# Altium schematic sheet 03-GPS.SchDoc
size A4; DocumentNumber: 19; SheetNumber: 19; SheetTotal: 34
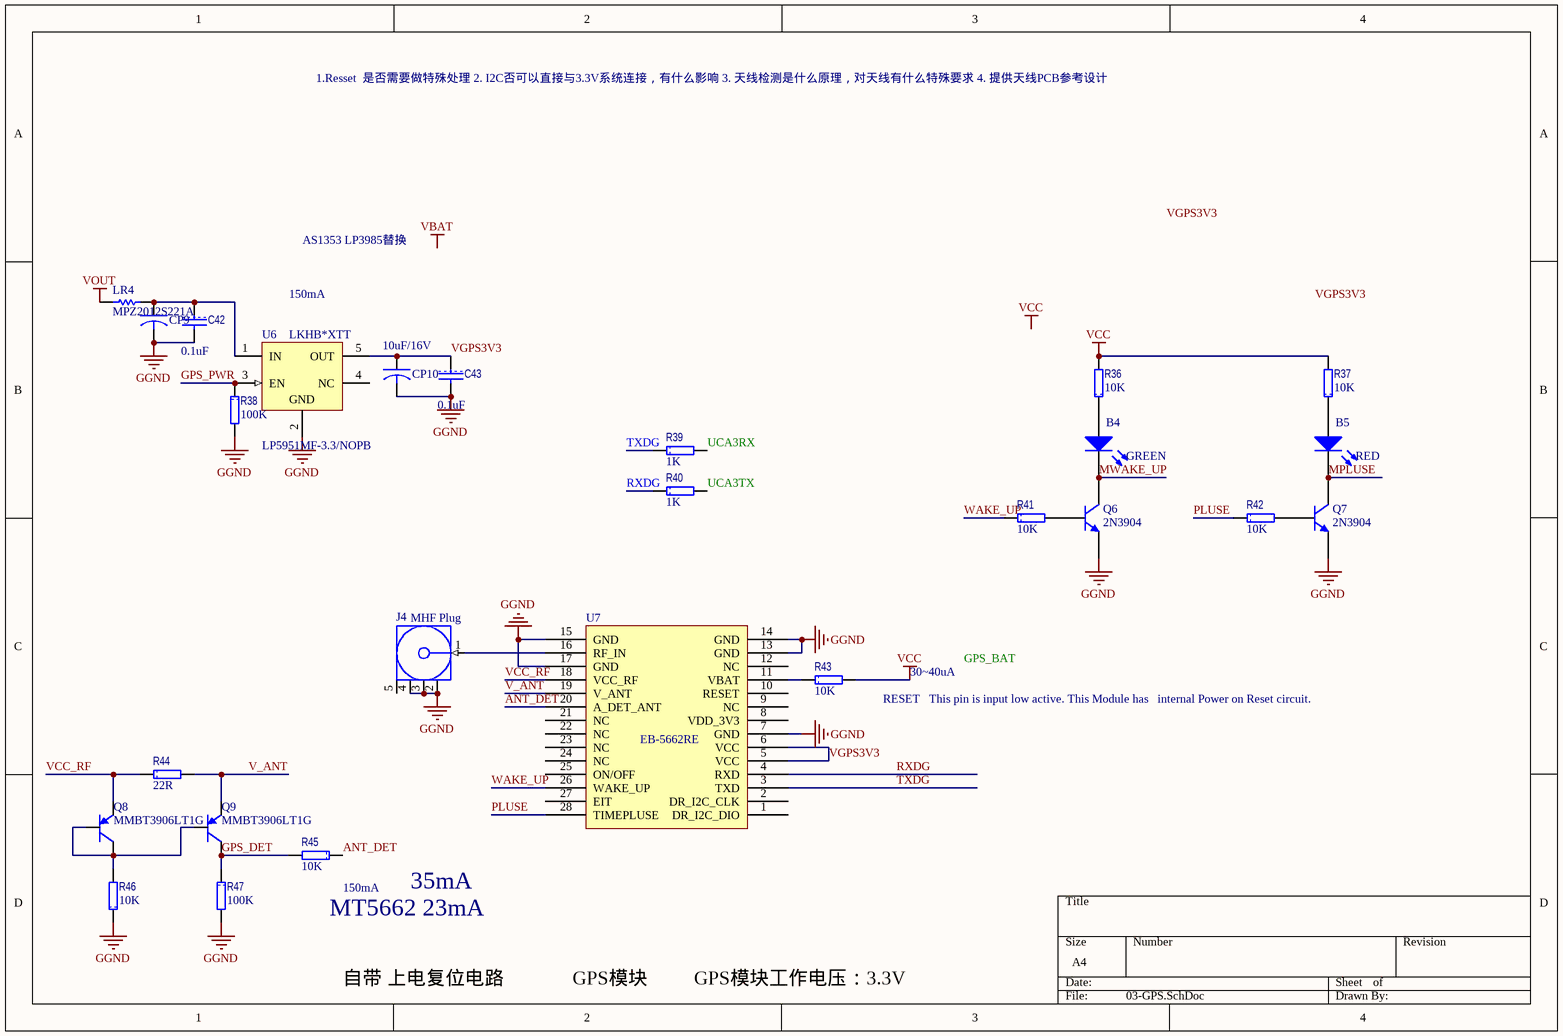
[diagram p0: 03-GPS.SchDoc]

## Parts
B4  GREEN  [0805LED]
B5  RED  [0805LED]
C42  value 0.1uF  [1608[0603]C]  (hidden comment: C1608X7R1H104K)
C43  value 0.1uF  [1608[0603]C]  (hidden comment: C1608X7R1H104K)
CP9  TAJA106K016RNJ  [3216[1206]CB]  (value not drawn)
CP10  value 10uF/16V  [3216[1206]CB]  (hidden comment: TAJA106K016RNJ)
J4  MHF Plug  [MHF[MCB3]-V4]
LR4  MPZ2012S221A  [2012[0805]]
Q6  2N3904  [SOT23_N]
Q7  2N3904  [SOT23_N]
Q8  MMBT3906LT1G  [SOT23_N]
Q9  MMBT3906LT1G  [SOT23_N]
R36  value 10K  [1608[0603]R]  (hidden comment: CRCW060310K0FKEA)
R37  value 10K  [1608[0603]R]  (hidden comment: CRCW060310K0FKEA)
R38  value 100K  [1608[0603]R]  (hidden comment: CRCW0603100KFKEA)
R39  value 1K  [1608[0603]R]  (hidden comment: CRCW06031K00FKEA)
R40  value 1K  [1608[0603]R]  (hidden comment: CRCW06031K00FKEA)
R41  value 10K  [1608[0603]R]  (hidden comment: CRCW060310K0FKEA)
R42  value 10K  [1608[0603]R]  (hidden comment: CRCW060310K0FKEA)
R43  value 10K  [1608[0603]R]  (hidden comment: CRCW060310K0FKEA)
R44  value 22R  [1608[0603]R]  (hidden comment: CRCW060322R0FKEA)
R45  value 10K  [1608[0603]R]  (hidden comment: CRCW060310K0FKEA)
R46  value 10K  [1608[0603]R]  (hidden comment: CRCW060310K0FKEA)
R47  value 100K  [1608[0603]R]  (hidden comment: CRCW0603100KFKEA)
U6  LP5951MF-3.3/NOPB  PackageTopMarking: LKHB*XTT  [MF05A_N]
U7  EB-5662RE  [EB-5662RE]

## Nets
GGND: C42.2 C43.2 CP9.2 CP10.2 J4.2(GND) J4.3(GND) J4.4(GND) Q6.1(E) Q7.1(E) R38.2 R46.1 R47.2 U6.2(GND) U7.7(GND) U7.13(GND) U7.14(GND) U7.15(GND) U7.17(GND)
VCC: R36.2 R37.2 R43.2
VOUT: LR4.1
ANT_DET: R45.1 U7.20(A_DET_ANT)
GPS_DET: Q9.3 R45.2 R47.1
GPS_PWR: R38.1 U6.3(EN)
MPLUSE: B5.2(K) Q7.3(C)
MWAKE_UP: B4.2(K) Q6.3(C)
PLUSE: R42.1 U7.28(TIMEPLUSE)
RXDG: R40.1 U7.4(RXD)
TXDG: R39.1 U7.3(TXD)
UCA3RX: R39.2
UCA3TX: R40.2
V_ANT: Q9.2 R44.2 U7.19(V_ANT)
VCC_RF: Q8.2 R44.1 U7.18(VCC_RF)
VGPS3V3: C43.1 CP10.1 U6.5(OUT) U7.5(VCC) U7.6(VCC)
WAKE_UP: R41.1 U7.26(WAKE_UP)
NetB4_1: B4.1(A) R36.1
NetB5_1: B5.1(A) R37.1
NetC42_1: C42.1 CP9.1 LR4.2 U6.1(IN)
NetJ4_1: J4.1(Signal) U7.16(RF_IN)
NetQ6_2: Q6.2(B) R41.2
NetQ7_2: Q7.2(B) R42.2
NetQ8_1: Q8.1 Q8.3 Q9.1 R46.2
NetR43_1: R43.1 U7.11(VBAT)

Not connected (* = marked no-connect by the designer): J4 5(GND); U6 4(NC); U7 1(DR_I2C_DIO) 2(DR_I2C_CLK) 8(VDD_3V3) 9(NC) 10(RESET) 12(NC) 21(NC) 22(NC) 23(NC) 24(NC) 25(ON/OFF) 27(EIT)

## Notes on the sheet
- 1.Resset  是否需要做特殊处理 2. I2C否可以直接与3.3V系统连接，有什么影响 3. 天线检测是什么原理，对天线有什么特殊要求 4. 提供天线PCB参考设计
- AS1353 LP3985替换
- 150mA
- (near R43) RESET   This pin is input low active. This Module has   internal Power on Reset circuit.
- 30~40uA
- (near R45) MT5662 23mA
- (near R45) 150mA
- 35mA
- 自带 上电复位电路
- GPS模块
- GPS模块工作电压：3.3V
- Labels drawn without touching a wire or pin: GPS_BAT, VBAT, VCC, VGPS3V3

## Library data of the parts
B4 B5 = LED2: Typical RED, GREEN, YELLOW, AMBER GaAs LED; Published: 8-Jun-2000; LatestRevisionDate: 17-Jul-2002; LatestRevisionNote: Re-released for DXP Platform.; PackageVersion: Feb-2002; PackageReference: 3.2X1.6X1.1; Publisher: Altium Limited; PackageDescription: SM LED; 2 Flat Leads
C42 C43 = CAP: 多层陶瓷电容器MLCC - SMD/SMT 0603 0.1uF 50volts X7R 10%; Manufacturer: TDK; 产品: General Type MLCCs; 产品种类: Low & Medium Capacitance SMD Ceramic Chip Capacitors; 外壳代码 - in: 0603; 外壳代码 - mm: 1608; 封装 / 箱体: 0603 (1608 metric); 封装: Reel; 尺寸: 0.8 mm W x 1.6 mm L x 0.8 mm H; 工作温度范围: - 55 C to + 125 C; 标准包装数量: 4000; 电压额定值: 50 V; 电容-nF: 100 nF; 电容-pF: 100000 pF; 系列: C; Category: 多层陶瓷电容器MLCC - SMD/SMT; ComponentLink1Description: http://www.tdk.com/pdf/general_B11.pdf; ComponentLink1URL: http://www.tdk.com/pdf/general_B11.pdf; Description 1: 多层陶瓷电容器MLCC - SMD/SMT 0603 0.1uF 50volts X7R 10%; Manufacturer Part Number: C1608X7R1H104K; Minimum Order Quantity: 1; Pricing 1: 1=0.160, 50=0.070, 100=0.036, 500=0.019, 1000=0.013, 4000=0.010, 8000=0.009, 12000=0.008, 20000=0.007 (USD); Reeling: True; RoHS - 贸泽: Y; RoHS: RoHS Compliant; Stock 1: 224604; Supplier 1: Mouser; Supplier Part Number 1: 810-C1608X7R1H104K; 制造商: TDK; 容差: 10 %; 温度系数/代码: X7R; 电容: 0.1 uF; 端接类型: SMD/SMT
CP9 CP10 = CAPACITOR: 钽质电容器-固体SMD 16volts 10uF 10%; Manufacturer: AVX; ESR: 3 Ohms; 产品: Tantalum Solid Standard Grade - Other Various; 产品种类: SMD Tantalum Capacitors; 制造商库存号: A Case; 外壳代码 - in: 1206; 外壳代码 - mm: 3216; 封装 / 箱体: 1206 (3216 metric); 封装: Reel; 尺寸: 1.6 mm W x 3.2 mm L; 工作温度范围: - 55 C to + 125 C; 损耗因数 DF: 8; 标准包装数量: 2000; 漏泄电流: 1.6 uA; 电压额定值: 16 V; 端接类型: SMD/SMT; 系列: TAJ; 高度: 1.8 mm; Category: 钽质电容器-固体SMD; ComponentLink1Description: http://www.avx.com/docs/Catalogs/taj.pdf; ComponentLink1URL: http://www.avx.com/docs/Catalogs/taj.pdf; Description 1: 钽质电容器-固体SMD 16volts 10uF 10%; Manufacturer Part Number: TAJA106K016RNJ; Minimum Order Quantity: 1; Pricing 1: 1=0.600, 100=0.280, 200=0.250, 500=0.221, 1000=0.200, 2000=0.140, 5000=0.131, 10000=0.124, 25000=0.103 (USD); Reeling: True; RoHS - 贸泽: Y; RoHS: RoHS Compliant; Stock 1: 20335; Supplier 1: Mouser; Supplier Part Number 1: 581-TAJA106K016R; 制造商: AVX; 容差: 10 %; 电容: 10 uF
J4 = COAX-F: 插针 RF 连接器 ONBRD IPEX MHF RECEPTACLE; Manufacturer: Taoglas; Manufacturer Part Number: RECE-20279-001E-01; 触点电镀: Gold; 型式: Receptacle (Female); 方向: Right Angle; 封装: Reel; 产品: Connectors; 端接类型: SMD/SMT; 触点材料: Brass; 射频系列: U.FL; Product Status: New at Mouser; Supplier 1: Mouser; Supplier Part Number 1: 960-RECE20279001E01; RoHS: RoHS Compliant; Description 1: RF 连接器 ONBRD IPEX MHF RECEPTACLE; Category: RF 连接器; Stock 1: 8300; Pricing 1: 1=0.900, 50=0.869, 100=0.833, 250=0.810, 500=0.756, 1000=0.698, 5000=0.698 (USD); 制造商: Taoglas; RoHS - 贸泽: Y; Minimum Order Quantity: 1; Reeling: True; ComponentLink1URL: http://www.taoglas.com/images/product_images/original_images/RECE.20279.001E-%20IPEX%20MHFI%20(U.FL)%20Receptacle.pdf; ComponentLink1Description: http://www.taoglas.com/images/product_images/original_images/RECE.20279.001E-%20IPEX%20MHFI%20(U.FL)%20Receptacle.pdf
LR4 = Res Semi: 电磁干扰滤波珠子、扼流圈和阵列 Ferrite Chip Beads; Manufacturer: TDK; 阻抗: 220 Ohms; 最大直流电流: 3 A; 最大直流电阻: 0.04 Ohms; 工作温度范围: - 55 C to + 125 C; 封装 / 箱体: 2012; 封装: Reel; 端接类型: SMD/SMT; 容差: 25 %; 产品种类: Ferrite Beads; 标准包装数量: 4000; Supplier 1: Mouser; Supplier Part Number 1: 810-MPZ2012S221A; Manufacturer Part Number: MPZ2012S221A; RoHS: RoHS Compliant; Description 1: 电磁干扰滤波珠子、扼流圈和阵列 Ferrite Chip Beads; Category: 电磁干扰滤波珠子、扼流圈和阵列; Stock 1: 26540; Pricing 1: 1=0.070, 50=0.060, 100=0.053, 500=0.040, 1000=0.035, 4000=0.031, 8000=0.029, 12000=0.025 (USD); 制造商: TDK; RoHS - 贸泽: Y; Minimum Order Quantity: 1; Reeling: True; ComponentLink1URL: http://www.mouser.com/ds/2/400/e9413_mpz-24582.pdf; ComponentLink1Description: http://www.mouser.com/ds/2/400/e9413_mpz-24582.pdf
Q6 Q7 = 2N3904: NPN General Purpose Amplifier; Published: 8-Jun-2000; LatestRevisionDate: 15-Jan-2003; LatestRevisionNote: PCB Footprint 'BCY-W3/D4.7' replaced; DatasheetVersion: 1997; PackageVersion: Sep-1998; PackageReference: TO-92A; Publisher: Altium Limited; PackageDescription: TO, Flat Index; 3 In-Line, Axial Leads; Body Dia. 4.5mm; Leads 0.51 x 0.48 mm (max); ComponentLink1Description: Manufacturer Link; ComponentLink1URL: http://www.fairchildsemi.com/; ComponentLink2Description: Datasheet; ComponentLink2URL: http://www.fairchildsemi.com/ds/2N%2F2N3904.pdf
Q8 Q9 = MMBT3096: 两极晶体管 - BJT 200mA 40V PNP; Manufacturer: ON Semiconductor; 集电极—基极电压 VCBO: - 40 V; 配置: Single; 发射极 - 基极电压 VEBO: 5 V; 封装 / 箱体: SOT-23-3; 封装: Reel; 集电极—射极饱和电压: - 0.4 V; 集电极连续电流: - 0.2 A; 安装风格: SMD/SMT; 直流集电极/Base Gain hfe Min: 60 at 0.1 mA at 1 V; 增益带宽产品fT: 250 MHz; 最大直流电集电极电流: 0.2 A; 最大工作温度: + 150 C; 最大功率耗散: 225 mW; 最小工作温度: - 55 C; 产品种类: Transistors Bipolar- General Purpose; 标准包装数量: 3000; Supplier 1: Mouser; Supplier Part Number 1: 863-MMBT3906LT1G; Manufacturer Part Number: MMBT3906LT1G; RoHS: RoHS Compliant; Description 1: 两极晶体管 - BJT 200mA 40V PNP; Category: 两极晶体管 - BJT; Stock 1: 32950; Pricing 1: 1=0.110, 25=0.099, 100=0.042, 500=0.034, 1000=0.024, 2000=0.020, 3000=0.020, 5000=0.018, 10000=0.015, 25000=0.014 (USD); 集电极—发射极最大电压 VCEO: - 40 V; 晶体管极性: PNP; 制造商: ON Semiconductor; RoHS - 贸泽: Y; Minimum Order Quantity: 1; Reeling: True; ComponentLink1URL: http://www.mouser.com/ds/2/308/MMBT3906LT1-D-112192.pdf; ComponentLink1Description: http://www.mouser.com/ds/2/308/MMBT3906LT1-D-112192.pdf
R36 R37 R41-R43 R45 R46 = RES: 厚膜电阻器 - SMD 1/10watt 10Kohms 1%; Manufacturer: Vishay / Dale; 尺寸: 0.85 mm W x 1.55 mm L x 0.45 mm H; 工作温度范围: - 55 C to + 155 C; 封装 / 箱体: 0603 (1608 metric); 封装: Reel; 功率额定值: 100 mW; 产品: Thick Film Resistors SMD; 系列: CRCW; 温度系数: 100 PPM / K; 端接类型: SMD/SMT; 电压额定值: 75 V; 制造商: Vishay; 产品种类: 0603 Thick Film Chip Resistors; 标准包装数量: 5000; 外壳代码 - in: 0603; 外壳代码 - mm: 1608; Supplier 1: Mouser; Supplier Part Number 1: 71-CRCW0603-10K-E3; Manufacturer Part Number: CRCW060310K0FKEA; RoHS: RoHS Compliant By Exemption; Category: 厚膜电阻器 - SMD; Stock 1: 0; Pricing 1: 1=0.080, 10=0.013, 100=0.010, 1000=0.008, 5000=0.005, 25000=0.004, 50000=0.003 (USD); 电阻: 10 kOhms; 容差: 1 %; RoHS - 贸泽: E; Minimum Order Quantity: 1; Reeling: True; ComponentLink1URL: http://www.mouser.com/ds/2/427/dcrcwe3-109170.pdf; ComponentLink1Description: http://www.mouser.com/ds/2/427/dcrcwe3-109170.pdf; Description 1: 厚膜电阻器 - SMD 1/10watt 10Kohms 1%
R38 R47 = RES: 厚膜电阻器 - SMD 1/10watt 100Kohms 1%; Manufacturer: Vishay / Dale; 尺寸: 0.85 mm W x 1.55 mm L x 0.45 mm H; 工作温度范围: - 55 C to + 155 C; 封装 / 箱体: 0603 (1608 metric); 封装: Reel; 功率额定值: 100 mW; 产品: Thick Film Resistors SMD; 系列: CRCW; 温度系数: 100 PPM / K; 端接类型: SMD/SMT; 电压额定值: 75 V; 制造商: Vishay; 产品种类: 0603 Thick Film Chip Resistors; 标准包装数量: 5000; 外壳代码 - in: 0603; 外壳代码 - mm: 1608; Supplier 1: Mouser; Supplier Part Number 1: 71-CRCW0603-100K-E3; Manufacturer Part Number: CRCW0603100KFKEA; RoHS: RoHS Compliant By Exemption; Category: 厚膜电阻器 - SMD; Stock 1: 175756; Pricing 1: 1=0.080, 10=0.013, 100=0.010, 1000=0.008, 5000=0.005, 25000=0.004, 50000=0.003 (USD); 电阻: 100 kOhms; 容差: 1 %; RoHS - 贸泽: E; Minimum Order Quantity: 1; Reeling: True; ComponentLink1URL: http://www.mouser.com/ds/2/427/dcrcwe3-109170.pdf; ComponentLink1Description: http://www.mouser.com/ds/2/427/dcrcwe3-109170.pdf; Description 1: 厚膜电阻器 - SMD 1/10watt 100Kohms 1%
R39 R40 = RES: 厚膜电阻器 - SMD 1/10watt 1.0Kohms 1%; Manufacturer: Vishay / Dale; 尺寸: 0.85 mm W x 1.55 mm L x 0.45 mm H; 工作温度范围: - 55 C to + 155 C; 封装 / 箱体: 0603 (1608 metric); 封装: Reel; 功率额定值: 100 mW; 产品: Thick Film Resistors SMD; 电阻: 1 kOhms; 系列: CRCW; 温度系数: 100 PPM / K; 端接类型: SMD/SMT; 电压额定值: 75 V; 制造商: Vishay; 产品种类: 0603 Thick Film Chip Resistors; 标准包装数量: 5000; 外壳代码 - in: 0603; 外壳代码 - mm: 1608; Supplier 1: Mouser; Supplier Part Number 1: 71-CRCW0603-1.0K-E3; Manufacturer Part Number: CRCW06031K00FKEA; RoHS: RoHS Compliant By Exemption; Category: 厚膜电阻器 - SMD; Stock 1: 276938; Pricing 1: 1=0.080, 10=0.013, 100=0.010, 1000=0.008, 5000=0.005, 25000=0.004, 50000=0.003 (USD); 容差: 1 %; RoHS - 贸泽: E; Minimum Order Quantity: 1; Reeling: True; ComponentLink1URL: http://www.mouser.com/ds/2/427/dcrcwe3-109170.pdf; ComponentLink1Description: http://www.mouser.com/ds/2/427/dcrcwe3-109170.pdf; Description 1: 厚膜电阻器 - SMD 1/10watt 1.0Kohms 1%
R44 = RES: 厚膜电阻器 - SMD 1/10watt 22ohms 1%; Manufacturer: Vishay / Dale; 尺寸: 0.85 mm W x 1.55 mm L x 0.45 mm H; 工作温度范围: - 55 C to + 155 C; 封装 / 箱体: 0603 (1608 metric); 封装: Reel; 功率额定值: 100 mW; 产品: Thick Film Resistors SMD; 系列: CRCW; 温度系数: 100 PPM / K; 端接类型: SMD/SMT; 电压额定值: 75 V; 制造商: Vishay; 标准包装数量: 5000; 外壳代码 - in: 0603; 外壳代码 - mm: 1608; 产品种类: 0603 Thick Film Chip Resistors; Supplier 1: Mouser; Supplier Part Number 1: 71-CRCW0603-22-E3; Manufacturer Part Number: CRCW060322R0FKEA; RoHS: RoHS Compliant By Exemption; Category: 厚膜电阻器 - SMD; Stock 1: 35802; 电阻: 22 Ohms; 容差: 1 %; Minimum Order Quantity: 1; Reeling: True; ComponentLink1URL: http://www.mouser.com/ds/2/427/dcrcwe3-109170.pdf; ComponentLink1Description: http://www.mouser.com/ds/2/427/dcrcwe3-109170.pdf; Description 1: 厚膜电阻器 - SMD 1/10watt 22ohms 1%; Pricing 1: 1=0.080, 10=0.013, 100=0.010, 1000=0.008, 5000=0.005, 25000=0.004, 50000=0.003 (USD); RoHS - 贸泽: E
U6 = LP5951MF-3.3/NOPB: Micropower, 150mA Low-Dropout CMOS Voltage Regulator, 5-pin SOT-23, Pb-Free; Manufacturer: National Semiconductor; PowerWise: N; CompType: LDO IC; Published: 1-Mar-2010; DatasheetVersion: May-2007; PackageVersion: revD, Aug-2008; PackageReference: MF05A; Publisher: Altium Limited; PackageDescription: Molded SOT-23, .115 x .063 x .040 in Body, 5 Lead, .0375 in Pitch; Supplier 1: Digi-Key; Supplier Part Number 1: LP5951MF-3.3TR-ND; Supplier 2: Digi-Key; Supplier Part Number 2: LP5951MF-3.3CT-ND; Supplier 3: Digi-Key; Supplier Part Number 3: LP5951MF-3.3DKR-ND; Supplier 4: Farnell; Supplier Part Number 4: 1559259; PartNumber: LP5951MF-3.3/NOPB; RoHS: Y; PinCount: 5; ComponentLink1Description: LP5951 Datasheet; ComponentLink1URL: http://www.national.com/ds/LP/LP5951.pdf; ComponentLink2Description: LP5951 Web Page; ComponentLink2URL: http://www.national.com/pf/LP/LP5951.html; ComponentLink3Description: MF05A Package Page; ComponentLink3URL: http://www.national.com/packaging/folders/mf05a.html
U7 = EB-5662RE: GPS模块; 公司: Globalsat